# Altium project 4501-WB_AV_BMS.PrjPCB
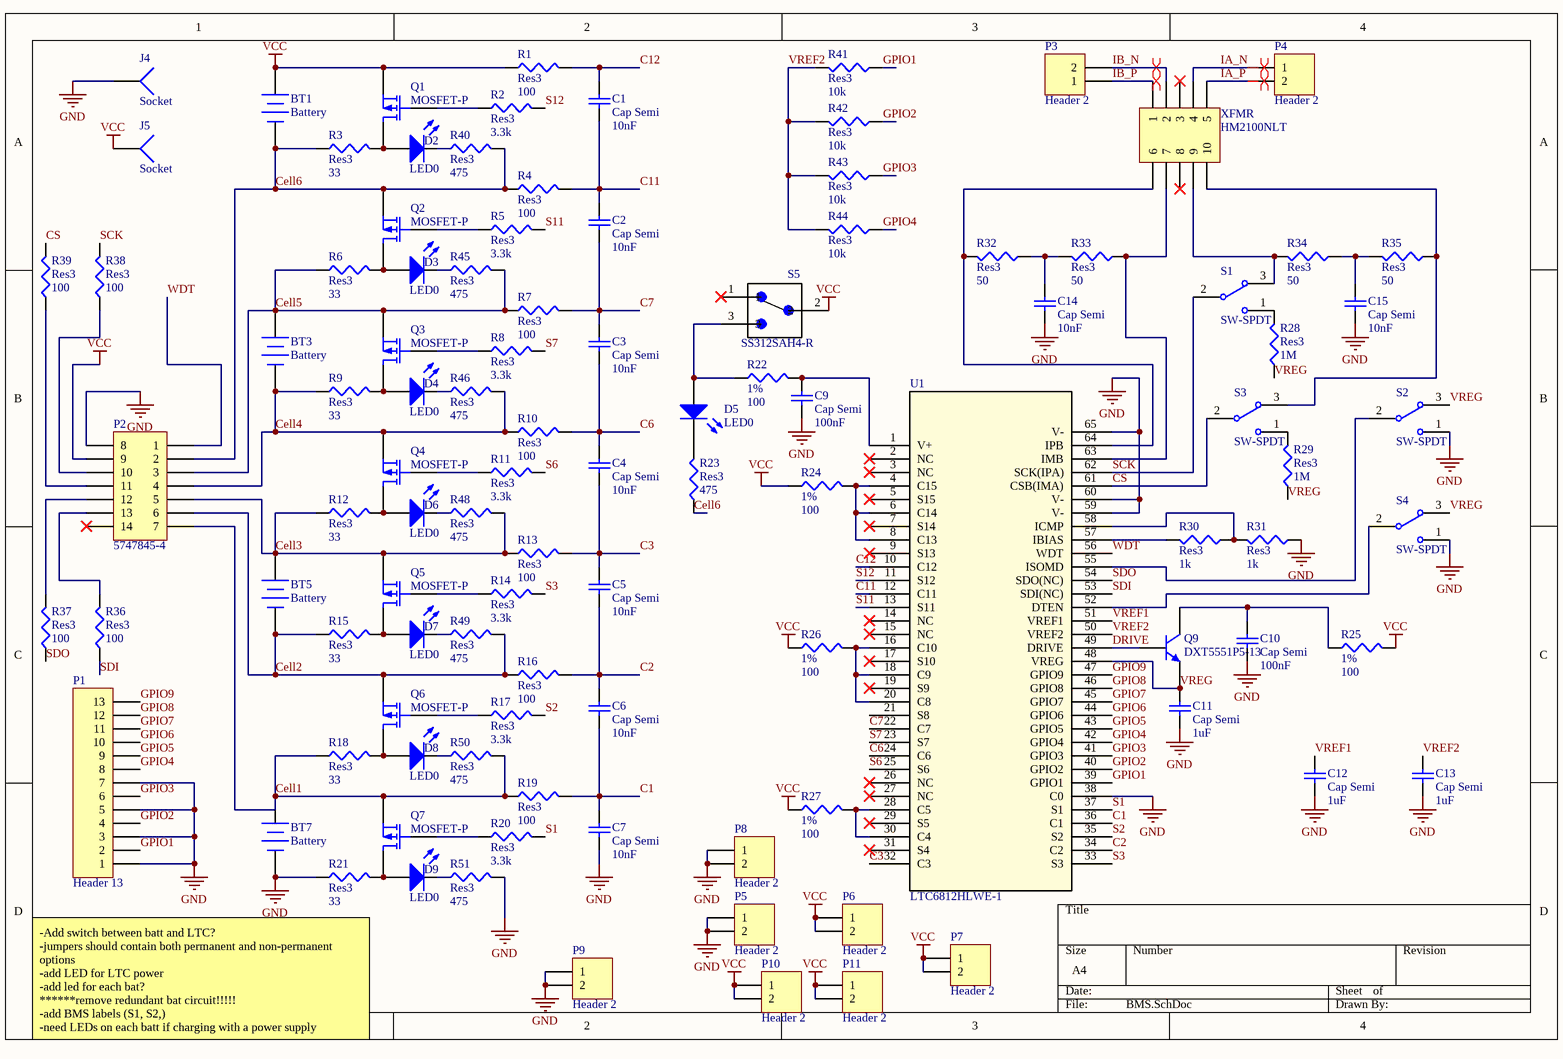
[diagram p0: BMS.SchDoc]
1 sheet, 104 parts. Net scope: global (net labels, ports and power ports of the same name join across sheets).
Board file: 4501-WB_AV_BMS.PcbDoc

## Sheet BMS.SchDoc
size A4

### Parts
BT1  Battery  [PCBComponent_1]
BT3  Battery  [PCBComponent_1]
BT5  Battery  [PCBComponent_1]
BT7  Battery  [PCBComponent_1]
C1  Cap Semi  value 10nF  [1608[0603]]
C2  Cap Semi  value 10nF  [1608[0603]]
C3  Cap Semi  value 10nF  [1608[0603]]
C4  Cap Semi  value 10nF  [1608[0603]]
C5  Cap Semi  value 10nF  [1608[0603]]
C6  Cap Semi  value 10nF  [1608[0603]]
C7  Cap Semi  value 10nF  [1608[0603]]
C9  Cap Semi  value 100nF  [6-0805_N]
C10  Cap Semi  value 100nF  [6-0805_N]
C11  Cap Semi  value 1uF  [6-0805_N]
C12  Cap Semi  value 1uF  [6-0805_N]
C13  Cap Semi  value 1uF  [6-0805_N]
C14  Cap Semi  value 10nF  [1608[0603]]
C15  Cap Semi  value 10nF  [1608[0603]]
D2  LED0  [J1-0603]
D3  LED0  [J1-0603]
D4  LED0  [J1-0603]
D5  LED0  [J1-0603]
D6  LED0  [J1-0603]
D7  LED0  [J1-0603]
D8  LED0  [J1-0603]
D9  LED0  [J1-0603]
J4  Socket  [PCBComponent_1]
J5  Socket  [PCBComponent_1]
P1  Header 13  [PCBComponent_1]
P2  5747845-4  [*5747845-4]
P3  Header 2  [WM4900-ND]
P4  Header 2  [WM4900-ND]
P5  Header 2  [PCBComponent_1]
P6  Header 2  [PCBComponent_1]
P7  Header 2  [PCBComponent_1]
P8  Header 2  [PCBComponent_1]
P9  Header 2  [PCBComponent_1]
P10  Header 2  [PCBComponent_1]
P11  Header 2  [PCBComponent_1]
Q1  MOSFET-P  [SOT95P245X110-3N]
Q2  MOSFET-P  [SOT95P245X110-3N]
Q3  MOSFET-P  [SOT95P245X110-3N]
Q4  MOSFET-P  [SOT95P245X110-3N]
Q5  MOSFET-P  [SOT95P245X110-3N]
Q6  MOSFET-P  [SOT95P245X110-3N]
Q7  MOSFET-P  [SOT95P245X110-3N]
Q9  DXT5551P5-13  [DXT5551P5-13]
R1  Res3  value 100  [J1-0603]
R2  Res3  value 3.3k  [J1-0603]
R3  Res3  value 33  [12Z-2010]
R4  Res3  value 100  [J1-0603]
R5  Res3  value 3.3k  [J1-0603]
R6  Res3  value 33  [12Z-2010]
R7  Res3  value 100  [J1-0603]
R8  Res3  value 3.3k  [J1-0603]
R9  Res3  value 33  [12Z-2010]
R10  Res3  value 100  [J1-0603]
R11  Res3  value 3.3k  [J1-0603]
R12  Res3  value 33  [12Z-2010]
R13  Res3  value 100  [J1-0603]
R14  Res3  value 3.3k  [J1-0603]
R15  Res3  value 33  [12Z-2010]
R16  Res3  value 100  [J1-0603]
R17  Res3  value 3.3k  [J1-0603]
R18  Res3  value 33  [12Z-2010]
R19  Res3  value 100  [J1-0603]
R20  Res3  value 3.3k  [J1-0603]
R21  Res3  value 33  [12Z-2010]
R22  1%  value 100  [J1-0603]
R23  Res3  value 475  [J1-0603]
R24  1%  value 100  [J1-0603]
R25  1%  value 100  [J1-0603]
R26  1%  value 100  [J1-0603]
R27  1%  value 100  [J1-0603]
R28  Res3  value 1M  [J1-0603]
R29  Res3  value 1M  [J1-0603]
R30  Res3  value 1k  [J1-0603]
R31  Res3  value 1k  [J1-0603]
R32  Res3  value 50  [J1-0603]
R33  Res3  value 50  [J1-0603]
R34  Res3  value 50  [J1-0603]
R35  Res3  value 50  [J1-0603]
R36  Res3  value 100  [J1-0603]
R37  Res3  value 100  [J1-0603]
R38  Res3  value 100  [J1-0603]
R39  Res3  value 100  [J1-0603]
R40  Res3  value 475  [J1-0603]
R41  Res3  value 10k  [J1-0603]
R42  Res3  value 10k  [J1-0603]
R43  Res3  value 10k  [J1-0603]
R44  Res3  value 10k  [J1-0603]
R45  Res3  value 475  [J1-0603]
R46  Res3  value 475  [J1-0603]
R48  Res3  value 475  [J1-0603]
R49  Res3  value 475  [J1-0603]
R50  Res3  value 475  [J1-0603]
R51  Res3  value 475  [J1-0603]
S1  SW-SPDT  [*TSM-103-01-L-SV]
S2  SW-SPDT  [*TSM-103-01-L-SV]
S3  SW-SPDT  [*TSM-103-01-L-SV]
S4  SW-SPDT  [*TSM-103-01-L-SV]
S5  SS312SAH4-R  [*SW_SS312SAH4-R]
U1  LTC6812HLWE-1  [LQFP64_LWE_A - duplicate]
XFMR  HM2100NLT  [HM2100NLT]

### Nets
GND: BT7.2(-) C7.1 C9.1 C10.1 C11.1 C12.1 C13.1 C14.1 C15.1 J4.1 P1.1 P1.3 P1.5 P1.7 P2.8 P5.1 P5.2 P8.1 P8.2 P9.1 P9.2 R21.2 R31.2 R51.1 S2.1 S4.1 U1.38(C0) U1.59(V-) U1.60(V-) U1.65(V-)
VCC: BT1.1(+) J5.1 P2.9 P6.1 P6.2 P7.1 P7.2 P10.1 P10.2 P11.1 P11.2 Q1.3(S) R1.1 R24.1 R25.2 R26.1 R27.1 S5.2
C1: C6.1 C7.2 R19.2 U1.36(C1)
C2: C5.1 C6.2 R16.2 U1.34(C2)
C3: C4.1 C5.2 R13.2 U1.32(C3)
C6: C3.1 C4.2 R10.2 U1.24(C6)
C7: C2.1 C3.2 R7.2 U1.22(C7)
C11: C1.1 C2.2 R4.2 U1.12(C11)
C12: C1.2 R1.2 U1.10(C12)
Cell1: BT7.1(+) P2.7 Q7.3(S) R18.2 R19.1 R50.1
Cell2: BT5.2(-) P2.6 Q6.3(S) R15.2 R16.1 R49.1
Cell3: BT5.1(+) P2.5 Q5.3(S) R12.2 R13.1 R48.1
Cell4: BT3.2(-) P2.4 Q4.3(S) R9.2 R10.1 R46.1
Cell5: BT3.1(+) P2.3 Q3.3(S) R6.2 R7.1 R45.1
Cell6: BT1.2(-) P2.2 Q2.3(S) R3.2 R4.1 R23.2 R40.1
CS: R39.1 S3.2 U1.61(CSB(IMA))
DRIVE: Q9.2(B) U1.49(DRIVE)
GPIO1: P1.2 R41.2 U1.39(GPIO1)
GPIO2: P1.4 R42.2 U1.40(GPIO2)
GPIO3: P1.6 R43.2 U1.41(GPIO3)
GPIO4: P1.8 R44.2 U1.42(GPIO4)
GPIO5: P1.9 U1.43(GPIO5)
GPIO6: P1.10 U1.44(GPIO6)
GPIO7: P1.11 U1.45(GPIO7)
GPIO8: P1.12 U1.46(GPIO8)
GPIO9: P1.13 U1.47(GPIO9)
IA_N: P4.1 XFMR.4
IA_P: P4.2 XFMR.5
IB_N: P3.2 XFMR.2
IB_P: P3.1 XFMR.1
S1: R20.2 U1.37(S1)
S2: R17.2 U1.35(S2)
S3: R14.2 U1.33(S3)
S6: R11.2 U1.25(S6)
S7: R8.2 U1.23(S7)
S11: R5.2 U1.13(S11)
S12: R2.2 U1.11(S12)
SCK: R38.1 S1.2 U1.62(SCK(IPA))
SDI: R36.2 U1.53(SDI(NC))
SDO: R37.2 U1.54(SDO(NC))
VREF1: C12.2 U1.51(VREF1)
VREF2: C13.2 R41.1 R42.1 R43.1 R44.1 U1.50(VREF2)
VREG: C11.2 Q9.1(E) R28.2 R29.2 S2.3 S4.3 U1.48(VREG)
WDT: P2.1 U1.56(WDT)
NetC9_2: C9.2 R22.1 U1.1(V+)
NetC10_2: C10.2 Q9.3(C) R25.1
NetC14_2: C14.2 R32.2 R33.1
NetC15_2: C15.2 R34.2 R35.1
NetD2_1: D2.1(A) Q1.1(D) R3.1
NetD2_2: D2.2(K) R40.2
NetD3_1: D3.1(A) Q2.1(D) R6.1
NetD3_2: D3.2(K) R45.2
NetD4_1: D4.1(A) Q3.1(D) R9.1
NetD4_2: D4.2(K) R46.2
NetD5_1: D5.1(A) R22.2 S5.3
NetD5_2: D5.2(K) R23.1
NetD6_1: D6.1(A) Q4.1(D) R12.1
NetD6_2: D6.2(K) R48.2
NetD7_1: D7.1(A) Q5.1(D) R15.1
NetD7_2: D7.2(K) R49.2
NetD8_1: D8.1(A) Q6.1(D) R18.1
NetD8_2: D8.2(K) R50.2
NetD9_1: D9.1(A) Q7.1(D) R21.1
NetD9_2: D9.2(K) R51.2
NetP2_10: P2.10 R38.2
NetP2_11: P2.11 R39.2
NetP2_12: P2.12 R37.1
NetP2_13: P2.13 R36.1
NetQ1_2: Q1.2(G) R2.1
NetQ2_2: Q2.2(G) R5.1
NetQ3_2: Q3.2(G) R8.1
NetQ4_2: Q4.2(G) R11.1
NetQ5_2: Q5.2(G) R14.1
NetQ6_2: Q6.2(G) R17.1
NetQ7_2: Q7.2(G) R20.1
NetR24_2: R24.2 U1.4(C15) U1.6(C14) U1.8(C13)
NetR26_2: R26.2 U1.16(C10) U1.18(C9) U1.20(C8)
NetR27_2: R27.2 U1.28(C5) U1.30(C4)
NetR28_1: R28.1 S1.1
NetR29_1: R29.1 S3.1
NetR30_1: R30.1 U1.57(IBIAS)
NetR30_2: R30.2 R31.1 U1.58(ICMP)
NetR32_1: R32.1 U1.64(IPB) XFMR.6
NetR33_2: R33.2 U1.63(IMB) XFMR.7
NetR34_1: R34.1 S1.3 XFMR.9
NetR35_2: R35.2 S3.3 XFMR.10
NetS2_2: S2.2 U1.55(ISOMD)
NetS4_2: S4.2 U1.52(DTEN)

Not connected (* = marked no-connect by the designer): P2 14*; S5 1*; U1 2(NC)* 3(NC)* 5(S15)* 7(S14)* 9(S13)* 14(NC)* 15(NC)* 17(S10)* 19(S9)* 21(S8) 26(NC)* 27(NC)* 29(S5)* 31(S4)*; XFMR 3* 8*

### Layout directives
differential pair: IA_N, IA_P, IB_N, IB_P

### Notes on the sheet
- -Add switch between batt and LTC?
  -jumpers should contain both permanent and non-permanent options
  -add LED for LTC power
  -add led for each bat?
  ******remove redundant bat circuit!!!!!
  -add BMS labels (S1, S2,)
  -need LEDs on each batt if charging with a power supply

### Library data of the parts
BT1 BT3 BT5 BT7 = Battery: Multicell Battery; Published: 24-Mar-1999; LatestRevisionDate: 17-Jul-2002; LatestRevisionNote: Re-released for DXP Platform.; PackageReference: BAT-2; Publisher: Altium Limited; PackageDescription: Battery; 2 Leads
C1-C7 C14 C15 = Cap Semi: Capacitor (Semiconductor SIM Model); SPN: 399-1092-1-ND; Published: 8-Jun-2000; LatestRevisionDate: 29-May-2009; LatestRevisionNote: IPC-7351 Footprint Added.; PackageReference: C1206; Publisher: Altium Limited; PackageDescription: Chip Capacitor
C9 C10 = Cap Semi: Capacitor (Semiconductor SIM Model); SPN: 1276-1090-1-ND; Published: 8-Jun-2000; LatestRevisionDate: 29-May-2009; LatestRevisionNote: IPC-7351 Footprint Added.; PackageReference: C1206; Publisher: Altium Limited; PackageDescription: Chip Capacitor
C11-C13 = Cap Semi: Capacitor (Semiconductor SIM Model); SPN: 311-3498-1-ND; Published: 8-Jun-2000; LatestRevisionDate: 29-May-2009; LatestRevisionNote: IPC-7351 Footprint Added.; PackageReference: C1206; Publisher: Altium Limited; PackageDescription: Chip Capacitor
D2-D4 D6-D9 = LED0: Typical INFRARED GaAs LED; SPN: 160-1435-1-ND; Published: 8-Jun-2000; LatestRevisionDate: 08-Jul-2005; LatestRevisionNote: Mech Layer 1 removed.; PackageReference: LED-0; Publisher: Altium Limited; PackageDescription: LED; 2 Leads
D5 = LED0: Typical INFRARED GaAs LED; SPN: 160-1646-1-ND; Published: 8-Jun-2000; LatestRevisionDate: 08-Jul-2005; LatestRevisionNote: Mech Layer 1 removed.; PackageReference: LED-0; Publisher: Altium Limited; PackageDescription: LED; 2 Leads
P1 = Header 13: Header, 13-Pin; LatestRevisionDate: 17-Jul-2002; LatestRevisionNote: Re-released for DXP Platform.; Publisher: Altium Limited
P2 = Header 7X2A: Header, 7-Pin, Dual row; LatestRevisionDate: 17-Jul-2002; LatestRevisionNote: Re-released for DXP Platform.; Publisher: Altium Limited
P3 P4 = Header 2: Header, 2-Pin; LatestRevisionDate: 17-Jul-2002; LatestRevisionNote: Re-released for DXP Platform.; Publisher: Altium Limited
P5-P11 = Header 2: Header, 2-Pin; SPN: 36-5104-ND; LatestRevisionDate: 17-Jul-2002; LatestRevisionNote: Re-released for DXP Platform.; Publisher: Altium Limited
Q1-Q7 = MOSFET-P: P-Channel MOSFET; SPN: BSS308PEH6327XTSA1CT-ND; Published: 8-Jun-2000; LatestRevisionDate: 17-Jul-2002; LatestRevisionNote: Re-released for DXP Platform.; PackageVersion: 1995/1996; PackageReference: E3; Publisher: Altium Limited; PackageDescription: TO, Flat Index; 3 In-Line, Axial Leads; Body Dia. 4.6mm; Lead Dia. 0.5 mm (max)
Q9 = 2N3904: NPN General Purpose Amplifier; SPN: DXT5551P5-13CT-ND; Published: 8-Jun-2000; LatestRevisionDate: 15-Jan-2003; LatestRevisionNote: PCB Footprint 'BCY-W3/D4.7' replaced; DatasheetVersion: 1997; PackageVersion: Sep-1998; PackageReference: TO-92A; Publisher: Altium Limited; PackageDescription: TO, Flat Index; 3 In-Line, Axial Leads; Body Dia. 4.5mm; Leads 0.51 x 0.48 mm (max); ComponentLink1Description: Manufacturer Link; ComponentLink1URL: http://www.fairchildsemi.com/; ComponentLink2Description: Datasheet; ComponentLink2URL: http://www.fairchildsemi.com/ds/2N%2F2N3904.pdf
R1 R4 R7 R10 R13 R16 R19 R22 R24 R25 R27 R36-R39 = Res3: Resistor; Parameter 1: A129676CT-ND; Published: 8-Jun-2000; LatestRevisionDate: 29-May-2009; LatestRevisionNote: IPC-7351 Footprint Added.; PackageReference: J1-0603; Publisher: Altium Limited; PackageDescription: Chip Resistor; SPN: A129676CT-ND
R2 R5 R8 R11 R14 R17 R20 = Res3: Resistor; SPN: A129543CT-ND; Published: 8-Jun-2000; LatestRevisionDate: 29-May-2009; LatestRevisionNote: IPC-7351 Footprint Added.; PackageReference: J1-0603; Publisher: Altium Limited; PackageDescription: Chip Resistor
R3 R6 R9 R12 R15 R18 R21 = Res3: Resistor; SPN: A130642CT-ND; Published: 8-Jun-2000; LatestRevisionDate: 29-May-2009; LatestRevisionNote: IPC-7351 Footprint Added.; PackageReference: J1-0603; Publisher: Altium Limited; PackageDescription: Chip Resistor
R23 R40 R45 R46 R48-R51 = Res3: Resistor; SPN: RMCF2010JT33R0CT-ND; Published: 8-Jun-2000; LatestRevisionDate: 29-May-2009; LatestRevisionNote: IPC-7351 Footprint Added.; PackageReference: J1-0603; Publisher: Altium Limited; PackageDescription: Chip Resistor
R26 = Res3: Resistor; SPN: A129676CT-ND; Published: 8-Jun-2000; LatestRevisionDate: 29-May-2009; LatestRevisionNote: IPC-7351 Footprint Added.; PackageReference: J1-0603; Publisher: Altium Limited; PackageDescription: Chip Resistor
R28 R29 = Res3: Resistor; SPN: A129724CT-ND; Published: 8-Jun-2000; LatestRevisionDate: 29-May-2009; LatestRevisionNote: IPC-7351 Footprint Added.; PackageReference: J1-0603; Publisher: Altium Limited; PackageDescription: Chip Resistor
R30 R31 = Res3: Resistor; SPN: RNCP0603FTD1K00CT-ND; Published: 8-Jun-2000; LatestRevisionDate: 29-May-2009; LatestRevisionNote: IPC-7351 Footprint Added.; PackageReference: J1-0603; Publisher: Altium Limited; PackageDescription: Chip Resistor
R32-R35 = Res3: Resistor; SPN: 311-2598-1-ND; Published: 8-Jun-2000; LatestRevisionDate: 29-May-2009; LatestRevisionNote: IPC-7351 Footprint Added.; PackageReference: J1-0603; Publisher: Altium Limited; PackageDescription: Chip Resistor
R41-R44 = Res3: Resistor; Published: 8-Jun-2000; LatestRevisionDate: 29-May-2009; LatestRevisionNote: IPC-7351 Footprint Added.; PackageReference: J1-0603; Publisher: Altium Limited; PackageDescription: Chip Resistor
S1-S4 = SW-SPDT: SPDT Subminiature Toggle Switch, Right Angle Mounting, Vertical Actuation; SPN: S9337-ND, SAM8981-ND; Published: 24-Mar-1999; LatestRevisionDate: 17-Dec-2003; LatestRevisionNote: Schematic revised, PCB Footprint replaced.; DatasheetVersion: 05-Dec-2000; PackageReference: TL36WW15050; Publisher: Altium Limited; PackageDescription: Switch; 4 Leads; ComponentLink1Description: Manufacturer Link; ComponentLink1URL: http://www.apem.com
S5 = SS312SAH4-R: Switch Slide ON None ON SPDT Side Slide 0.1A 28VAC 28VDC 0.4VA 10000Cycles Gull Wing SMD T/R; MF: NKK Switches; Package: None; MP: SS312SAH4-R; SnapEDA_Link: https://www.snapeda.com/parts/SS312SAH4-R/NKK%20Switches/view-part/?ref=snap; Price: None; Availability: Unavailable; Value: *
U1 = LTC6812HLWE-1: No Description Available; Copyright: Copyright (C) 2018 Accelerated Designs. All rights reserved; RefDes: RefDes; Type: DEV; Value: Value
XFMR = Header 5X2A: Header, 5-Pin, Dual row; SPN: 1840-1032-1-ND; LatestRevisionDate: 17-Jul-2002; LatestRevisionNote: Re-released for DXP Platform.; Publisher: Altium Limited
J4 J5 = Socket: LatestRevisionDate: 17-Jul-2002; LatestRevisionNote: Re-released for DXP Platform.; Publisher: Altium Limited